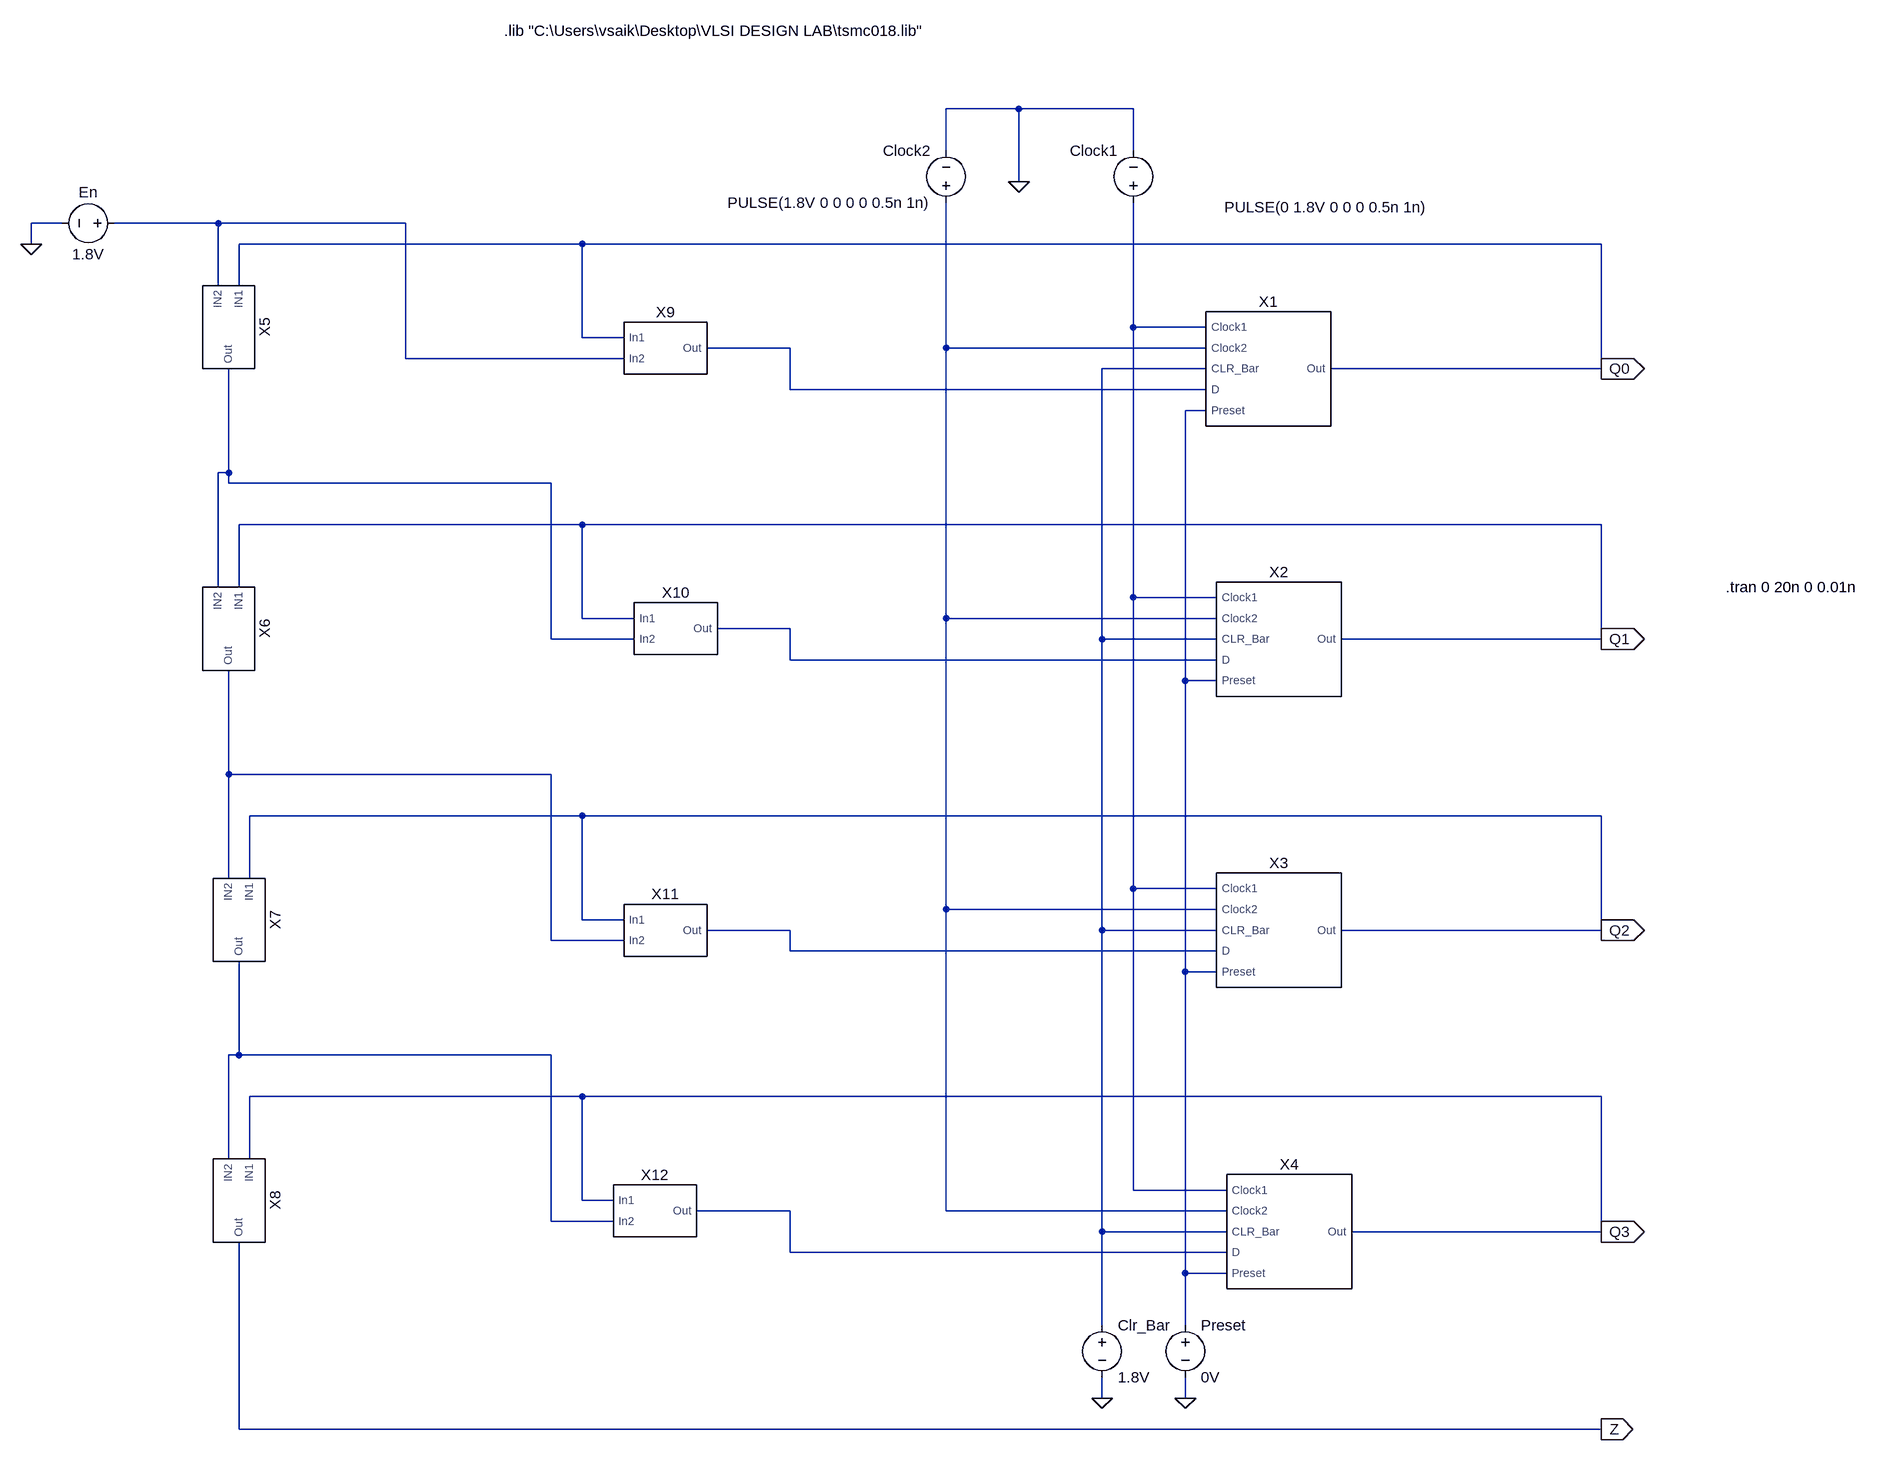
[diagram p0: schematic Counter1_P_Clr2.asc]
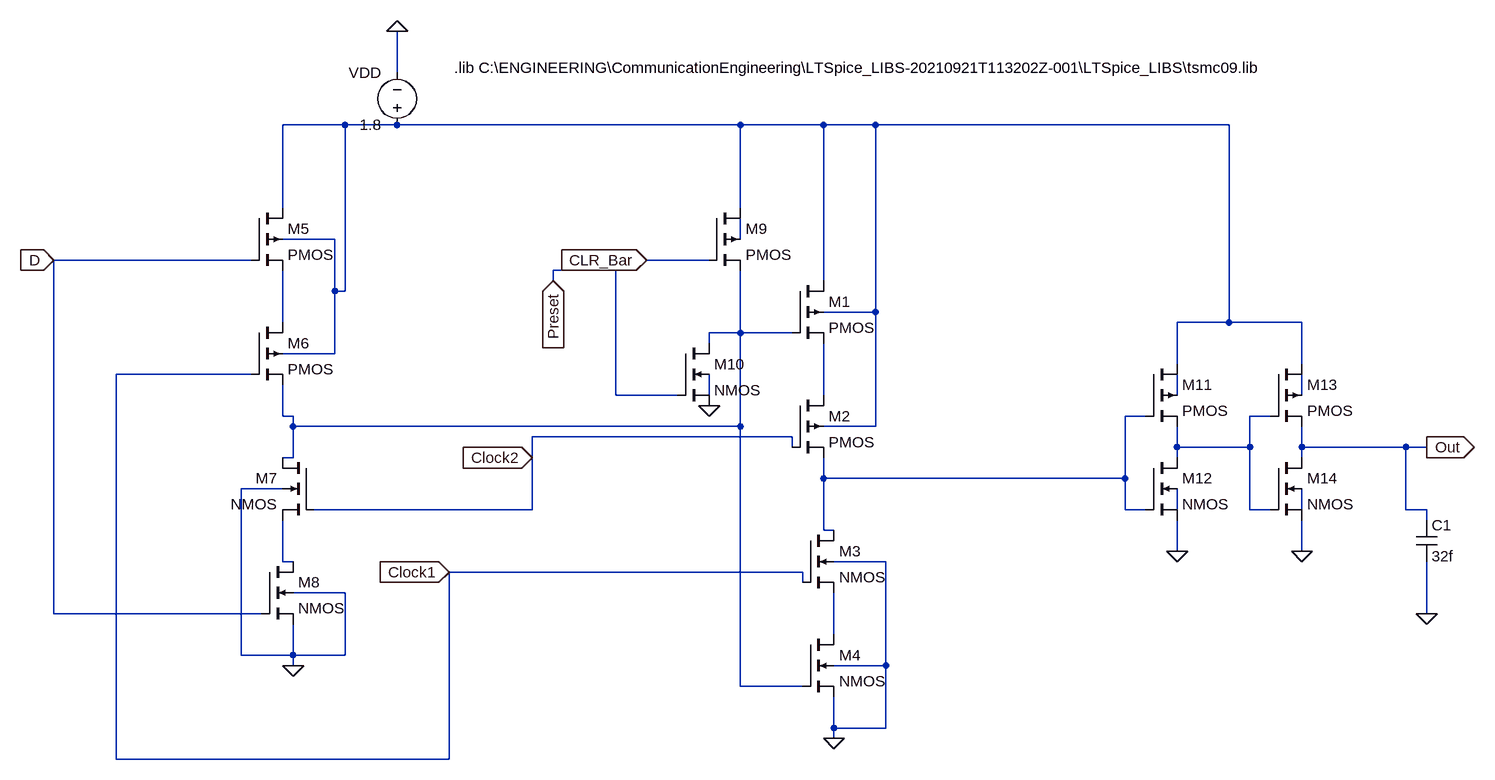
[diagram p1: sub-circuit d_flip_flop_880_440_buffer_pr_clr.asc]
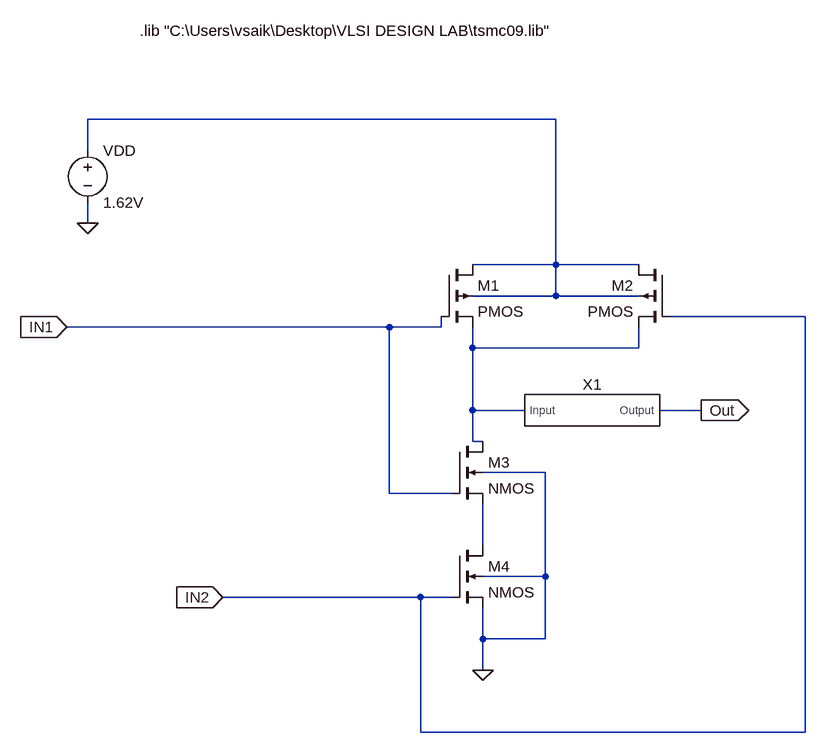
[diagram p2: sub-circuit and_model1.asc]
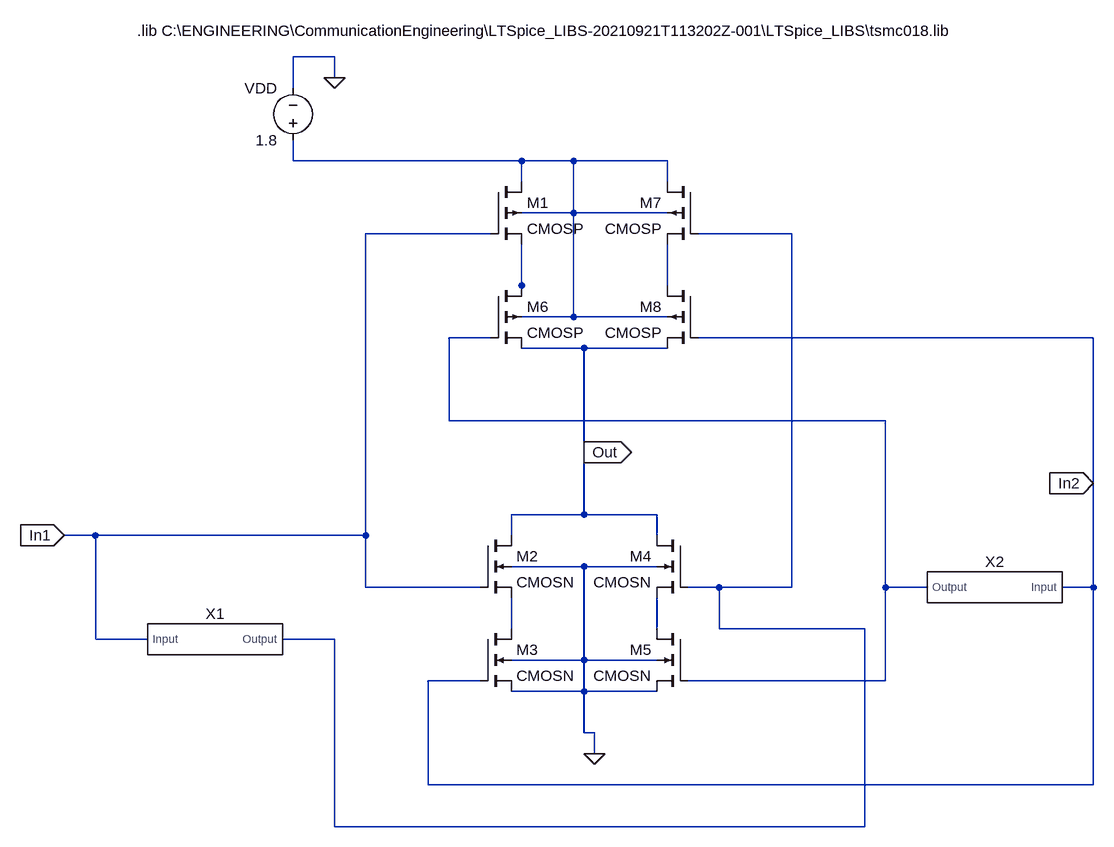
[diagram p3: sub-circuit xor_model1.asc]
Counter1_P_Clr2.asc, the LTspice schematic file:
Version 4
SHEET 1 2224 2288
WIRE 912 160 800 160
WIRE 1088 160 912 160
WIRE 800 224 800 160
WIRE 1088 224 1088 160
WIRE 912 272 912 160
WIRE -560 336 -608 336
WIRE -320 336 -480 336
WIRE -32 336 -320 336
WIRE -608 368 -608 336
WIRE 240 368 -288 368
WIRE 1808 368 240 368
WIRE -320 432 -320 336
WIRE -288 432 -288 368
WIRE 1088 496 1088 304
WIRE 1200 496 1088 496
WIRE 240 512 240 368
WIRE 304 512 240 512
WIRE 560 528 432 528
WIRE 800 528 800 304
WIRE 1200 528 800 528
WIRE -32 544 -32 336
WIRE 304 544 -32 544
WIRE 1200 560 1040 560
WIRE 1808 560 1808 368
WIRE 1808 560 1392 560
WIRE 560 592 560 528
WIRE 1200 592 560 592
WIRE 1200 624 1168 624
WIRE -304 720 -304 560
WIRE -304 720 -320 720
WIRE -304 736 -304 720
WIRE 192 736 -304 736
WIRE 240 800 -288 800
WIRE 1808 800 240 800
WIRE -320 896 -320 720
WIRE -288 896 -288 800
WIRE 1088 912 1088 496
WIRE 1216 912 1088 912
WIRE 240 944 240 800
WIRE 320 944 240 944
WIRE 800 944 800 528
WIRE 1216 944 800 944
WIRE 560 960 448 960
WIRE 192 976 192 736
WIRE 320 976 192 976
WIRE 1040 976 1040 560
WIRE 1216 976 1040 976
WIRE 1808 976 1808 800
WIRE 1808 976 1408 976
WIRE 560 1008 560 960
WIRE 1216 1008 560 1008
WIRE 1168 1040 1168 624
WIRE 1216 1040 1168 1040
WIRE -304 1184 -304 1024
WIRE 192 1184 -304 1184
WIRE 240 1248 -272 1248
WIRE 1808 1248 240 1248
WIRE -304 1344 -304 1184
WIRE -272 1344 -272 1248
WIRE 1088 1360 1088 912
WIRE 1216 1360 1088 1360
WIRE 800 1392 800 944
WIRE 1216 1392 800 1392
WIRE 240 1408 240 1248
WIRE 304 1408 240 1408
WIRE 560 1424 432 1424
WIRE 1040 1424 1040 976
WIRE 1216 1424 1040 1424
WIRE 1808 1424 1808 1248
WIRE 1808 1424 1408 1424
WIRE 192 1440 192 1184
WIRE 304 1440 192 1440
WIRE 560 1456 560 1424
WIRE 1216 1456 560 1456
WIRE 1168 1488 1168 1040
WIRE 1216 1488 1168 1488
WIRE -288 1616 -288 1472
WIRE -288 1616 -304 1616
WIRE 192 1616 -288 1616
WIRE 240 1680 -272 1680
WIRE 1808 1680 240 1680
WIRE -304 1776 -304 1616
WIRE -272 1776 -272 1680
WIRE 1088 1824 1088 1360
WIRE 1232 1824 1088 1824
WIRE 240 1840 240 1680
WIRE 288 1840 240 1840
WIRE 560 1856 416 1856
WIRE 800 1856 800 1392
WIRE 1232 1856 800 1856
WIRE 192 1872 192 1616
WIRE 288 1872 192 1872
WIRE 1040 1888 1040 1424
WIRE 1232 1888 1040 1888
WIRE 1808 1888 1808 1680
WIRE 1808 1888 1424 1888
WIRE 560 1920 560 1856
WIRE 1232 1920 560 1920
WIRE 1168 1952 1168 1488
WIRE 1232 1952 1168 1952
WIRE 1040 2032 1040 1888
WIRE 1168 2032 1168 1952
WIRE 1040 2144 1040 2112
WIRE 1168 2144 1168 2112
WIRE -288 2192 -288 1904
WIRE 1808 2192 -288 2192
FLAG -608 368 0
FLAG 1040 2144 0
FLAG 1168 2144 0
FLAG 912 272 0
FLAG 1808 2192 Z
IOPIN 1808 2192 Out
FLAG 1808 560 Q0
IOPIN 1808 560 Out
FLAG 1808 976 Q1
IOPIN 1808 976 Out
FLAG 1808 1424 Q2
IOPIN 1808 1424 Out
FLAG 1808 1888 Q3
IOPIN 1808 1888 Out
SYMBOL D_Flip_Flop_880_440_buffer_Pr_Clr 1296 560 R0
SYMATTR InstName X1
SYMBOL D_Flip_Flop_880_440_buffer_Pr_Clr 1312 976 R0
SYMATTR InstName X2
SYMBOL D_Flip_Flop_880_440_buffer_Pr_Clr 1312 1424 R0
SYMATTR InstName X3
SYMBOL D_Flip_Flop_880_440_buffer_Pr_Clr 1328 1888 R0
SYMATTR InstName X4
SYMBOL AND_model1 -304 496 R90
SYMATTR InstName X5
SYMBOL AND_model1 -304 960 R90
SYMATTR InstName X6
SYMBOL AND_model1 -288 1408 R90
SYMATTR InstName X7
SYMBOL AND_model1 -288 1840 R90
SYMATTR InstName X8
SYMBOL XOR_model1 368 528 R0
SYMATTR InstName X9
SYMBOL XOR_model1 384 960 R0
SYMATTR InstName X10
SYMBOL XOR_model1 368 1424 R0
SYMATTR InstName X11
SYMBOL XOR_model1 352 1856 R0
SYMATTR InstName X12
SYMBOL voltage -464 336 R90
WINDOW 0 -32 56 VBottom 2
WINDOW 3 32 56 VTop 2
WINDOW 123 0 0 Left 0
WINDOW 39 0 0 Left 0
SYMATTR InstName En
SYMATTR Value 1.8V
SYMBOL voltage 1088 320 R180
WINDOW 0 24 96 Left 2
WINDOW 3 -453 9 Left 2
WINDOW 123 0 0 Left 0
WINDOW 39 0 0 Left 0
SYMATTR InstName Clock1
SYMATTR Value PULSE(0 1.8V 0 0 0 0.5n 1n)
SYMBOL voltage 800 320 R180
WINDOW 0 24 96 Left 2
WINDOW 3 24 16 Left 2
WINDOW 123 0 0 Left 0
WINDOW 39 0 0 Left 0
SYMATTR InstName Clock2
SYMATTR Value PULSE(1.8V 0 0 0 0 0.5n 1n)
SYMBOL voltage 1168 2016 R0
WINDOW 123 0 0 Left 0
WINDOW 39 0 0 Left 0
SYMATTR InstName Preset
SYMATTR Value 0V
SYMBOL voltage 1040 2016 R0
WINDOW 123 0 0 Left 0
WINDOW 39 0 0 Left 0
SYMATTR InstName Clr_Bar
SYMATTR Value 1.8V
TEXT 120 40 Left 2 !.lib "C:\\Users\\vsaik\\Desktop\\VLSI DESIGN LAB\\tsmc018.lib"
TEXT 2000 896 Left 2 !.tran 0 20n 0 0.01n

d_flip_flop_880_440_buffer_pr_clr.asc, the sub-circuit schematic file:
Version 4
SHEET 1 1644 1044
WIRE -160 -16 -160 -80
WIRE -240 64 -336 64
WIRE -160 64 -240 64
WIRE 368 64 -160 64
WIRE 496 64 368 64
WIRE 576 64 496 64
WIRE 1120 64 576 64
WIRE -336 192 -336 64
WIRE 368 192 368 64
WIRE -256 240 -336 240
WIRE 368 240 368 208
WIRE -384 272 -688 272
WIRE 320 272 224 272
WIRE 176 288 80 288
WIRE 80 304 80 288
WIRE 496 304 496 64
WIRE -256 320 -256 240
WIRE -240 320 -240 64
WIRE -240 320 -256 320
WIRE 576 352 576 64
WIRE 576 352 496 352
WIRE -336 368 -336 288
WIRE 1120 368 1120 64
WIRE 1120 368 1040 368
WIRE 1232 368 1120 368
WIRE 368 384 368 288
WIRE 368 384 320 384
WIRE 448 384 368 384
WIRE 320 400 320 384
WIRE -256 416 -256 320
WIRE -256 416 -336 416
WIRE 1040 432 1040 368
WIRE 1232 432 1232 368
WIRE -384 448 -592 448
WIRE 176 480 176 288
WIRE 272 480 176 480
WIRE 320 480 320 448
WIRE 496 480 496 400
WIRE 1040 480 1040 448
WIRE 1232 480 1232 448
WIRE -336 512 -336 464
WIRE -320 512 -336 512
WIRE 992 512 960 512
WIRE 1184 512 1152 512
WIRE -320 528 -320 512
WIRE 368 528 368 384
WIRE 368 528 -320 528
WIRE 576 528 576 352
WIRE 576 528 496 528
WIRE 448 544 48 544
WIRE 448 560 448 544
WIRE 1040 560 1040 528
WIRE 1152 560 1152 512
WIRE 1152 560 1040 560
WIRE 1232 560 1232 528
WIRE 1392 560 1232 560
WIRE 1424 560 1392 560
WIRE -320 576 -320 528
WIRE -320 576 -336 576
WIRE 48 576 48 544
WIRE 1040 576 1040 560
WIRE 1232 576 1232 560
WIRE 496 608 496 576
WIRE 960 608 960 512
WIRE 960 608 496 608
WIRE -336 624 -400 624
WIRE 48 656 48 576
WIRE 48 656 -288 656
WIRE 960 656 960 608
WIRE 992 656 960 656
WIRE 1040 656 1040 624
WIRE 1152 656 1152 560
WIRE 1184 656 1152 656
WIRE 1232 656 1232 624
WIRE 1392 656 1392 560
WIRE 1424 656 1392 656
WIRE 1424 672 1424 656
WIRE 496 688 496 608
WIRE 512 688 496 688
WIRE 1040 720 1040 672
WIRE 1232 720 1232 672
WIRE -336 736 -336 672
WIRE -320 736 -336 736
WIRE 592 736 512 736
WIRE 464 752 -80 752
WIRE 464 768 464 752
WIRE -240 784 -320 784
WIRE -688 816 -688 272
WIRE -368 816 -688 816
WIRE 1424 816 1424 736
WIRE 512 848 512 784
WIRE -400 880 -400 624
WIRE -320 880 -320 832
WIRE -320 880 -400 880
WIRE -240 880 -240 784
WIRE -240 880 -320 880
WIRE -320 896 -320 880
WIRE 592 896 592 736
WIRE 592 896 512 896
WIRE 368 928 368 528
WIRE 464 928 368 928
WIRE 512 992 512 944
WIRE 592 992 592 896
WIRE 592 992 512 992
WIRE 512 1008 512 992
WIRE -592 1040 -592 448
WIRE -80 1040 -80 752
WIRE -80 1040 -592 1040
FLAG -160 -80 0
FLAG 512 1008 0
FLAG 1424 816 0
FLAG -320 896 0
FLAG 320 496 0
FLAG 1232 720 0
FLAG 1040 720 0
FLAG -688 272 D
IOPIN -688 272 In
FLAG -80 752 Clock1
IOPIN -80 752 In
FLAG 48 576 Clock2
IOPIN 48 576 In
FLAG 1424 560 Out
IOPIN 1424 560 Out
FLAG 80 304 Preset
IOPIN 80 304 In
FLAG 224 272 CLR_Bar
IOPIN 224 272 In
SYMBOL pmos4 448 304 R0
SYMATTR InstName M1
SYMATTR Value2 l=90n w=440n
SYMBOL pmos4 448 480 R0
SYMATTR InstName M2
SYMATTR Value2 l=90n w=440n
SYMBOL nmos4 464 688 R0
SYMATTR InstName M3
SYMATTR Value2 l=90n w=220n
SYMBOL nmos4 464 848 R0
SYMATTR InstName M4
SYMATTR Value2 l=90n w=220n
SYMBOL voltage -160 80 R180
WINDOW 0 24 96 Left 2
WINDOW 3 24 16 Left 2
SYMATTR InstName VDD
SYMATTR Value 1.8
SYMBOL cap 1408 672 R0
SYMATTR InstName C1
SYMATTR Value 32f
SYMBOL pmos4 -384 192 R0
SYMATTR InstName M5
SYMATTR Value2 l=90n w=440n
SYMBOL pmos4 -384 368 R0
SYMATTR InstName M6
SYMATTR Value2 l=90n w=440n
SYMBOL nmos4 -288 576 M0
SYMATTR InstName M7
SYMATTR Value2 l=90n w=220n
SYMBOL nmos4 -368 736 R0
SYMATTR InstName M8
SYMATTR Value2 l=90n w=220n
SYMBOL pmos4 320 192 R0
SYMATTR InstName M9
SYMATTR Value2 l=90n w=440n
SYMBOL nmos4 272 400 R0
SYMATTR InstName M10
SYMATTR Value2 l=90n w=220n
SYMBOL pmos4 992 432 R0
SYMATTR InstName M11
SYMATTR Value2 l=90n w=440n
SYMBOL nmos4 992 576 R0
SYMATTR InstName M12
SYMATTR Value2 l=90n w=220n
SYMBOL pmos4 1184 432 R0
SYMATTR InstName M13
SYMATTR Value2 l=90n w=440n
SYMBOL nmos4 1184 576 R0
SYMATTR InstName M14
SYMATTR Value2 l=90n w=220n
TEXT -72 -24 Left 2 !.lib C:\\ENGINEERING\\CommunicationEngineering\\LTSpice_LIBS-20210921T113202Z-001\\LTSpice_LIBS\\tsmc09.lib

and_model1.asc, the sub-circuit schematic file:
Version 4
SHEET 1 1644 1012
WIRE 912 64 192 64
WIRE 192 112 192 64
WIRE 192 224 192 192
WIRE 912 288 912 64
WIRE 912 288 784 288
WIRE 1040 288 912 288
WIRE 912 336 912 288
WIRE 912 336 784 336
WIRE 1040 336 912 336
WIRE 1296 368 1088 368
WIRE 656 384 160 384
WIRE 736 384 736 368
WIRE 736 384 656 384
WIRE 784 416 784 384
WIRE 1040 416 1040 384
WIRE 1040 416 784 416
WIRE 784 512 784 416
WIRE 864 512 784 512
WIRE 1136 512 1072 512
WIRE 784 560 784 512
WIRE 800 560 784 560
WIRE 896 608 800 608
WIRE 656 640 656 384
WIRE 752 640 656 640
WIRE 800 720 800 656
WIRE 896 768 896 608
WIRE 896 768 800 768
WIRE 704 800 400 800
WIRE 752 800 704 800
WIRE 800 864 800 816
WIRE 896 864 896 768
WIRE 896 864 800 864
WIRE 800 912 800 864
WIRE 704 1008 704 800
WIRE 1296 1008 1296 368
WIRE 1296 1008 704 1008
FLAG 192 224 0
FLAG 800 912 0
FLAG 1136 512 Out
IOPIN 1136 512 Out
FLAG 160 384 IN1
IOPIN 160 384 In
FLAG 400 800 IN2
IOPIN 400 800 In
SYMBOL pmos4 736 288 R0
SYMATTR InstName M1
SYMATTR Value2 l=90n w=440n
SYMBOL pmos4 1088 288 M0
SYMATTR InstName M2
SYMATTR Value2 l=90n w=440n
SYMBOL nmos4 752 560 R0
SYMATTR InstName M3
SYMATTR Value2 l=90n w=220n
SYMBOL nmos4 752 720 R0
SYMATTR InstName M4
SYMATTR Value2 l=90n w=220n
SYMBOL voltage 192 96 R0
SYMATTR InstName VDD
SYMATTR Value 1.62V
SYMBOL NOT_model1 960 512 R0
SYMATTR InstName X1
TEXT 272 -72 Left 2 !.lib "C:\\Users\\vsaik\\Desktop\\VLSI DESIGN LAB\\tsmc09.lib"

xor_model1.asc, the sub-circuit schematic file:
Version 4
SHEET 1 2196 1236
WIRE 480 48 416 48
WIRE 480 80 480 48
WIRE 416 96 416 48
WIRE 416 208 416 176
WIRE 768 208 416 208
WIRE 848 208 768 208
WIRE 992 208 848 208
WIRE 768 240 768 208
WIRE 992 240 992 208
WIRE 848 288 848 208
WIRE 848 288 768 288
WIRE 992 288 848 288
WIRE 720 320 528 320
WIRE 1184 320 1040 320
WIRE 768 400 768 336
WIRE 992 400 992 336
WIRE 768 416 768 400
WIRE 848 448 848 288
WIRE 848 448 768 448
WIRE 992 448 848 448
WIRE 720 480 656 480
WIRE 1648 480 1040 480
WIRE 864 496 768 496
WIRE 992 496 864 496
WIRE 656 608 656 480
WIRE 1328 608 656 608
WIRE 864 656 864 496
WIRE 1648 704 1648 480
WIRE 864 752 864 656
WIRE 864 752 752 752
WIRE 976 752 864 752
WIRE 112 784 64 784
WIRE 528 784 528 320
WIRE 528 784 112 784
WIRE 752 784 752 752
WIRE 976 784 976 752
WIRE 864 832 752 832
WIRE 976 832 864 832
WIRE 528 864 528 784
WIRE 704 864 528 864
WIRE 1072 864 1024 864
WIRE 1184 864 1184 320
WIRE 1184 864 1072 864
WIRE 1328 864 1328 608
WIRE 1392 864 1328 864
WIRE 1648 864 1648 704
WIRE 1648 864 1600 864
WIRE 752 928 752 880
WIRE 976 928 976 880
WIRE 1072 928 1072 864
WIRE 1296 928 1072 928
WIRE 112 944 112 784
WIRE 192 944 112 944
WIRE 480 944 400 944
WIRE 864 976 864 832
WIRE 864 976 752 976
WIRE 976 976 864 976
WIRE 704 1008 624 1008
WIRE 1328 1008 1328 864
WIRE 1328 1008 1024 1008
WIRE 864 1024 864 976
WIRE 864 1024 752 1024
WIRE 976 1024 864 1024
WIRE 864 1088 864 1024
WIRE 880 1088 864 1088
WIRE 880 1120 880 1088
WIRE 624 1168 624 1008
WIRE 1648 1168 1648 864
WIRE 1648 1168 624 1168
WIRE 480 1232 480 944
WIRE 1296 1232 1296 928
WIRE 1296 1232 480 1232
FLAG 480 80 0
FLAG 880 1120 0
FLAG 64 784 In1
IOPIN 64 784 In
FLAG 1648 704 In2
IOPIN 1648 704 In
FLAG 864 656 Out
IOPIN 864 656 Out
SYMBOL pmos4 720 240 R0
SYMATTR InstName M1
SYMATTR Value CMOSP
SYMATTR Value2 l=180n w=1320n
SYMBOL nmos4 704 784 R0
SYMATTR InstName M2
SYMATTR Value CMOSN
SYMATTR Value2 l=180n w=440n
SYMBOL nmos4 704 928 R0
SYMATTR InstName M3
SYMATTR Value CMOSN
SYMATTR Value2 l=180n w=440n
SYMBOL nmos4 1024 784 M0
SYMATTR InstName M4
SYMATTR Value CMOSN
SYMATTR Value2 l=180n w=440n
SYMBOL nmos4 1024 928 M0
SYMATTR InstName M5
SYMATTR Value CMOSN
SYMATTR Value2 l=180n w=440n
SYMBOL voltage 416 192 R180
WINDOW 0 24 96 Left 2
WINDOW 3 24 16 Left 2
SYMATTR InstName VDD
SYMATTR Value 1.8
SYMBOL pmos4 720 400 R0
SYMATTR InstName M6
SYMATTR Value CMOSP
SYMATTR Value2 l=180n w=1320n
SYMBOL pmos4 1040 240 M0
SYMATTR InstName M7
SYMATTR Value CMOSP
SYMATTR Value2 l=180n w=1320n
SYMBOL pmos4 1040 400 M0
SYMATTR InstName M8
SYMATTR Value CMOSP
SYMATTR Value2 l=180n w=1320n
SYMBOL NOT_model1 288 944 R0
SYMATTR InstName X1
SYMBOL NOT_model1 1504 864 M0
SYMATTR InstName X2
TEXT 176 8 Left 2 !.lib C:\\ENGINEERING\\CommunicationEngineering\\LTSpice_LIBS-20210921T113202Z-001\\LTSpice_LIBS\\tsmc018.lib

The netlist it stands for:
* Counter1_P_Clr2.asc
XX1 N002 N004 N005 N003 N006 Q0 d_flip_flop_880_440_buffer_pr_clr
XX2 N002 N004 N005 N008 N006 Q1 d_flip_flop_880_440_buffer_pr_clr
XX3 N002 N004 N005 N010 N006 Q2 d_flip_flop_880_440_buffer_pr_clr
XX4 N002 N004 N005 N012 N006 Q3 d_flip_flop_880_440_buffer_pr_clr
XX5 Q0 N001 N007 and_model1
XX6 Q1 N007 N009 and_model1
XX7 Q2 N009 N011 and_model1
XX8 Q3 N011 Z and_model1
XX9 Q0 N001 N003 xor_model1
XX10 Q1 N007 N008 xor_model1
XX11 Q2 N009 N010 xor_model1
XX12 Q3 N011 N012 xor_model1
V§En N001 0 1.8V
V§Clock1 N002 0 PULSE(0 1.8V 0 0 0 0.5n 1n)
V§Clock2 N004 0 PULSE(1.8V 0 0 0 0 0.5n 1n)
V§Preset N006 0 0V
V§Clr_Bar N005 0 1.8V

* block symbol definitions
.subckt d_flip_flop_880_440_buffer_pr_clr Clock1 Clock2 CLR_Bar D Preset Out
M1 N001 N004 N006 N001 PMOS l=90n w=440n
M2 N006 Clock2 N009 N001 PMOS l=90n w=440n
M3 N009 Clock1 N014 0 NMOS l=90n w=220n
M4 N014 N004 0 0 NMOS l=90n w=220n
VDD N001 0 1.8
C1 Out 0 32f
M5 N001 D N003 N001 PMOS l=90n w=440n
M6 N003 Clock1 N004 N001 PMOS l=90n w=440n
M7 N004 Clock2 N013 0 NMOS l=90n w=220n
M8 N013 D 0 0 NMOS l=90n w=220n
M9 N001 CLR_Bar N004 N002 PMOS l=90n w=440n
M10 N004 Preset 0 N005 NMOS l=90n w=220n
M11 N001 N009 N010 N007 PMOS l=90n w=440n
M12 N010 N009 0 N011 NMOS l=90n w=220n
M13 N001 N010 Out N008 PMOS l=90n w=440n
M14 Out N010 0 N012 NMOS l=90n w=220n
.lib C:\ENGINEERING\CommunicationEngineering\LTSpice_LIBS-20210921T113202Z-001\LTSpice_LIBS\tsmc09.lib
.ends d_flip_flop_880_440_buffer_pr_clr

.subckt and_model1 IN1 IN2 Out
M1 N001 IN1 N002 N001 PMOS l=90n w=440n
M2 N001 IN2 N002 N001 PMOS l=90n w=440n
M3 N002 IN1 N003 0 NMOS l=90n w=220n
M4 N003 IN2 0 0 NMOS l=90n w=220n
VDD N001 0 1.62V
XX1 N002 Out NOT0  ; pins Input Output
.lib "C:\Users\vsaik\Desktop\VLSI DESIGN LAB\tsmc09.lib"
.ends and_model1

.subckt xor_model1 In1 In2 Out
M1 N001 In1 N003 N001 CMOSP l=180n w=1320n
M2 Out In1 N006 0 CMOSN l=180n w=440n
M3 N006 In2 0 0 CMOSN l=180n w=440n
M4 Out N002 N007 0 CMOSN l=180n w=440n
M5 N007 N005 0 0 CMOSN l=180n w=440n
VDD N001 0 1.8
M6 N003 N005 Out N001 CMOSP l=180n w=1320n
M7 N001 N002 N004 N001 CMOSP l=180n w=1320n
M8 N004 In2 Out N001 CMOSP l=180n w=1320n
XX1 In1 N002 NOT0  ; pins Input Output
XX2 In2 N005 NOT0  ; pins Input Output
.lib C:\ENGINEERING\CommunicationEngineering\LTSpice_LIBS-20210921T113202Z-001\LTSpice_LIBS\tsmc018.lib
.ends xor_model1

.model NMOS NMOS
.model PMOS PMOS
.lib standard.mos
.lib "C:\Users\vsaik\Desktop\VLSI DESIGN LAB\tsmc018.lib"
.tran 0 20n 0 0.01n
.backanno
.end

* Results of the author's LTspice run, read from the files saved beside the schematic
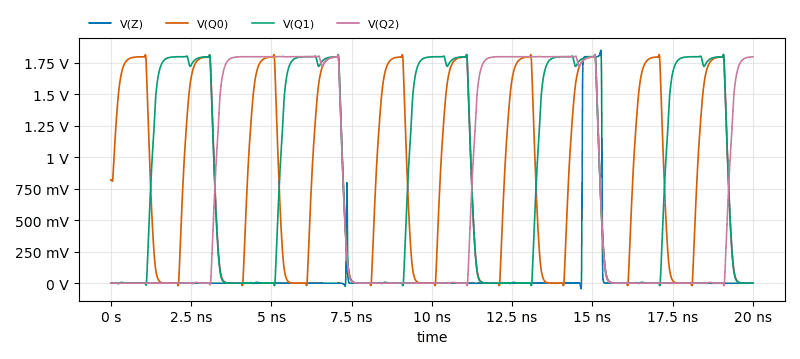
[diagram p4: Transient Analysis of Counter1_P_Clr2.asc, plotted from the saved traces]
* Transient Analysis, 1 run:
*   V(Z): min -44.93 mV, max 1.85 V, average 57.19 mV, rms 315.3 mV, last 0 V
*   V(Q0): min -20.38 mV, max 1.816 V, average 858.4 mV, rms 1.154 V, last 7.246 µV
*   V(Q1): min -20.26 mV, max 1.817 V, average 870.8 mV, rms 1.208 V, last 65.54 µV
*   V(Q2): min -20.31 mV, max 1.816 V, average 771.8 mV, rms 1.155 V, last 1.799 V